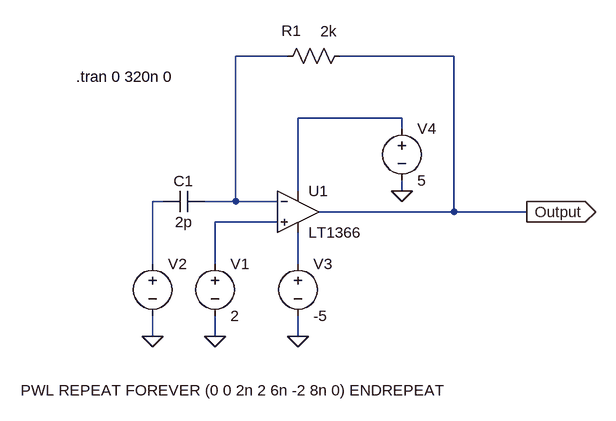
[diagram p0: schematic Differential mode in Op-amp.asc]
Differential mode in Op-amp.asc, the LTspice schematic file:
Version 4
SHEET 1 880 680
WIRE 160 -64 80 -64
WIRE 416 -64 240 -64
WIRE 336 32 176 32
WIRE 336 48 336 32
WIRE 176 144 176 32
WIRE 336 144 336 128
WIRE -32 160 -48 160
WIRE 80 160 80 -64
WIRE 80 160 32 160
WIRE 144 160 80 160
WIRE 416 176 416 -64
WIRE 416 176 208 176
WIRE 528 176 416 176
WIRE 144 192 48 192
WIRE -48 256 -48 160
WIRE 48 256 48 192
WIRE 176 256 176 208
WIRE -48 368 -48 336
WIRE 48 368 48 336
WIRE 176 368 176 336
FLAG -48 368 0
FLAG 48 368 0
FLAG 176 368 0
FLAG 336 144 0
FLAG 528 176 Output
IOPIN 528 176 Out
SYMBOL Opamps\\LT1366 176 112 R0
SYMATTR InstName U1
SYMBOL voltage 48 240 R0
WINDOW 123 0 0 Left 0
WINDOW 39 0 0 Left 0
SYMATTR InstName V1
SYMATTR Value 2
SYMBOL voltage -48 240 R0
WINDOW 3 -203 211 Left 2
WINDOW 123 0 0 Left 0
WINDOW 39 0 0 Left 0
SYMATTR InstName V2
SYMATTR Value PWL REPEAT FOREVER (0 0 2n 2 6n -2 8n 0) ENDREPEAT
SYMBOL voltage 176 240 R0
SYMATTR InstName V3
SYMATTR Value -5
SYMBOL voltage 336 32 R0
SYMATTR InstName V4
SYMATTR Value 5
SYMBOL res 256 -80 R90
WINDOW 0 -7 90 VBottom 2
WINDOW 3 -38 33 VTop 2
SYMATTR InstName R1
SYMATTR Value 2k
SYMBOL cap 32 144 R90
WINDOW 0 0 32 VBottom 2
WINDOW 3 32 32 VTop 2
SYMATTR InstName C1
SYMATTR Value 2p
TEXT -166 -32 Left 2 !.tran 0 320n 0

The netlist it stands for:
* Differential mode in Op-amp.asc
XU1 N004 N001 N002 N005 Output LT1366  ; pins In+ In- V+ V- OUT
V1 N004 0 2
V2 N003 0 PWL REPEAT FOREVER (0 0 2n 2 6n -2 8n 0) ENDREPEAT
V3 N005 0 -5
V4 N002 0 5
R1 Output N001 2k
C1 N001 N003 2p
.tran 0 320n 0
.lib LTC.lib
.backanno
.end